# Altium project PCB_Project_Transmit_Stend_ver0.0.1.PrjPcb (part 2 of 2)
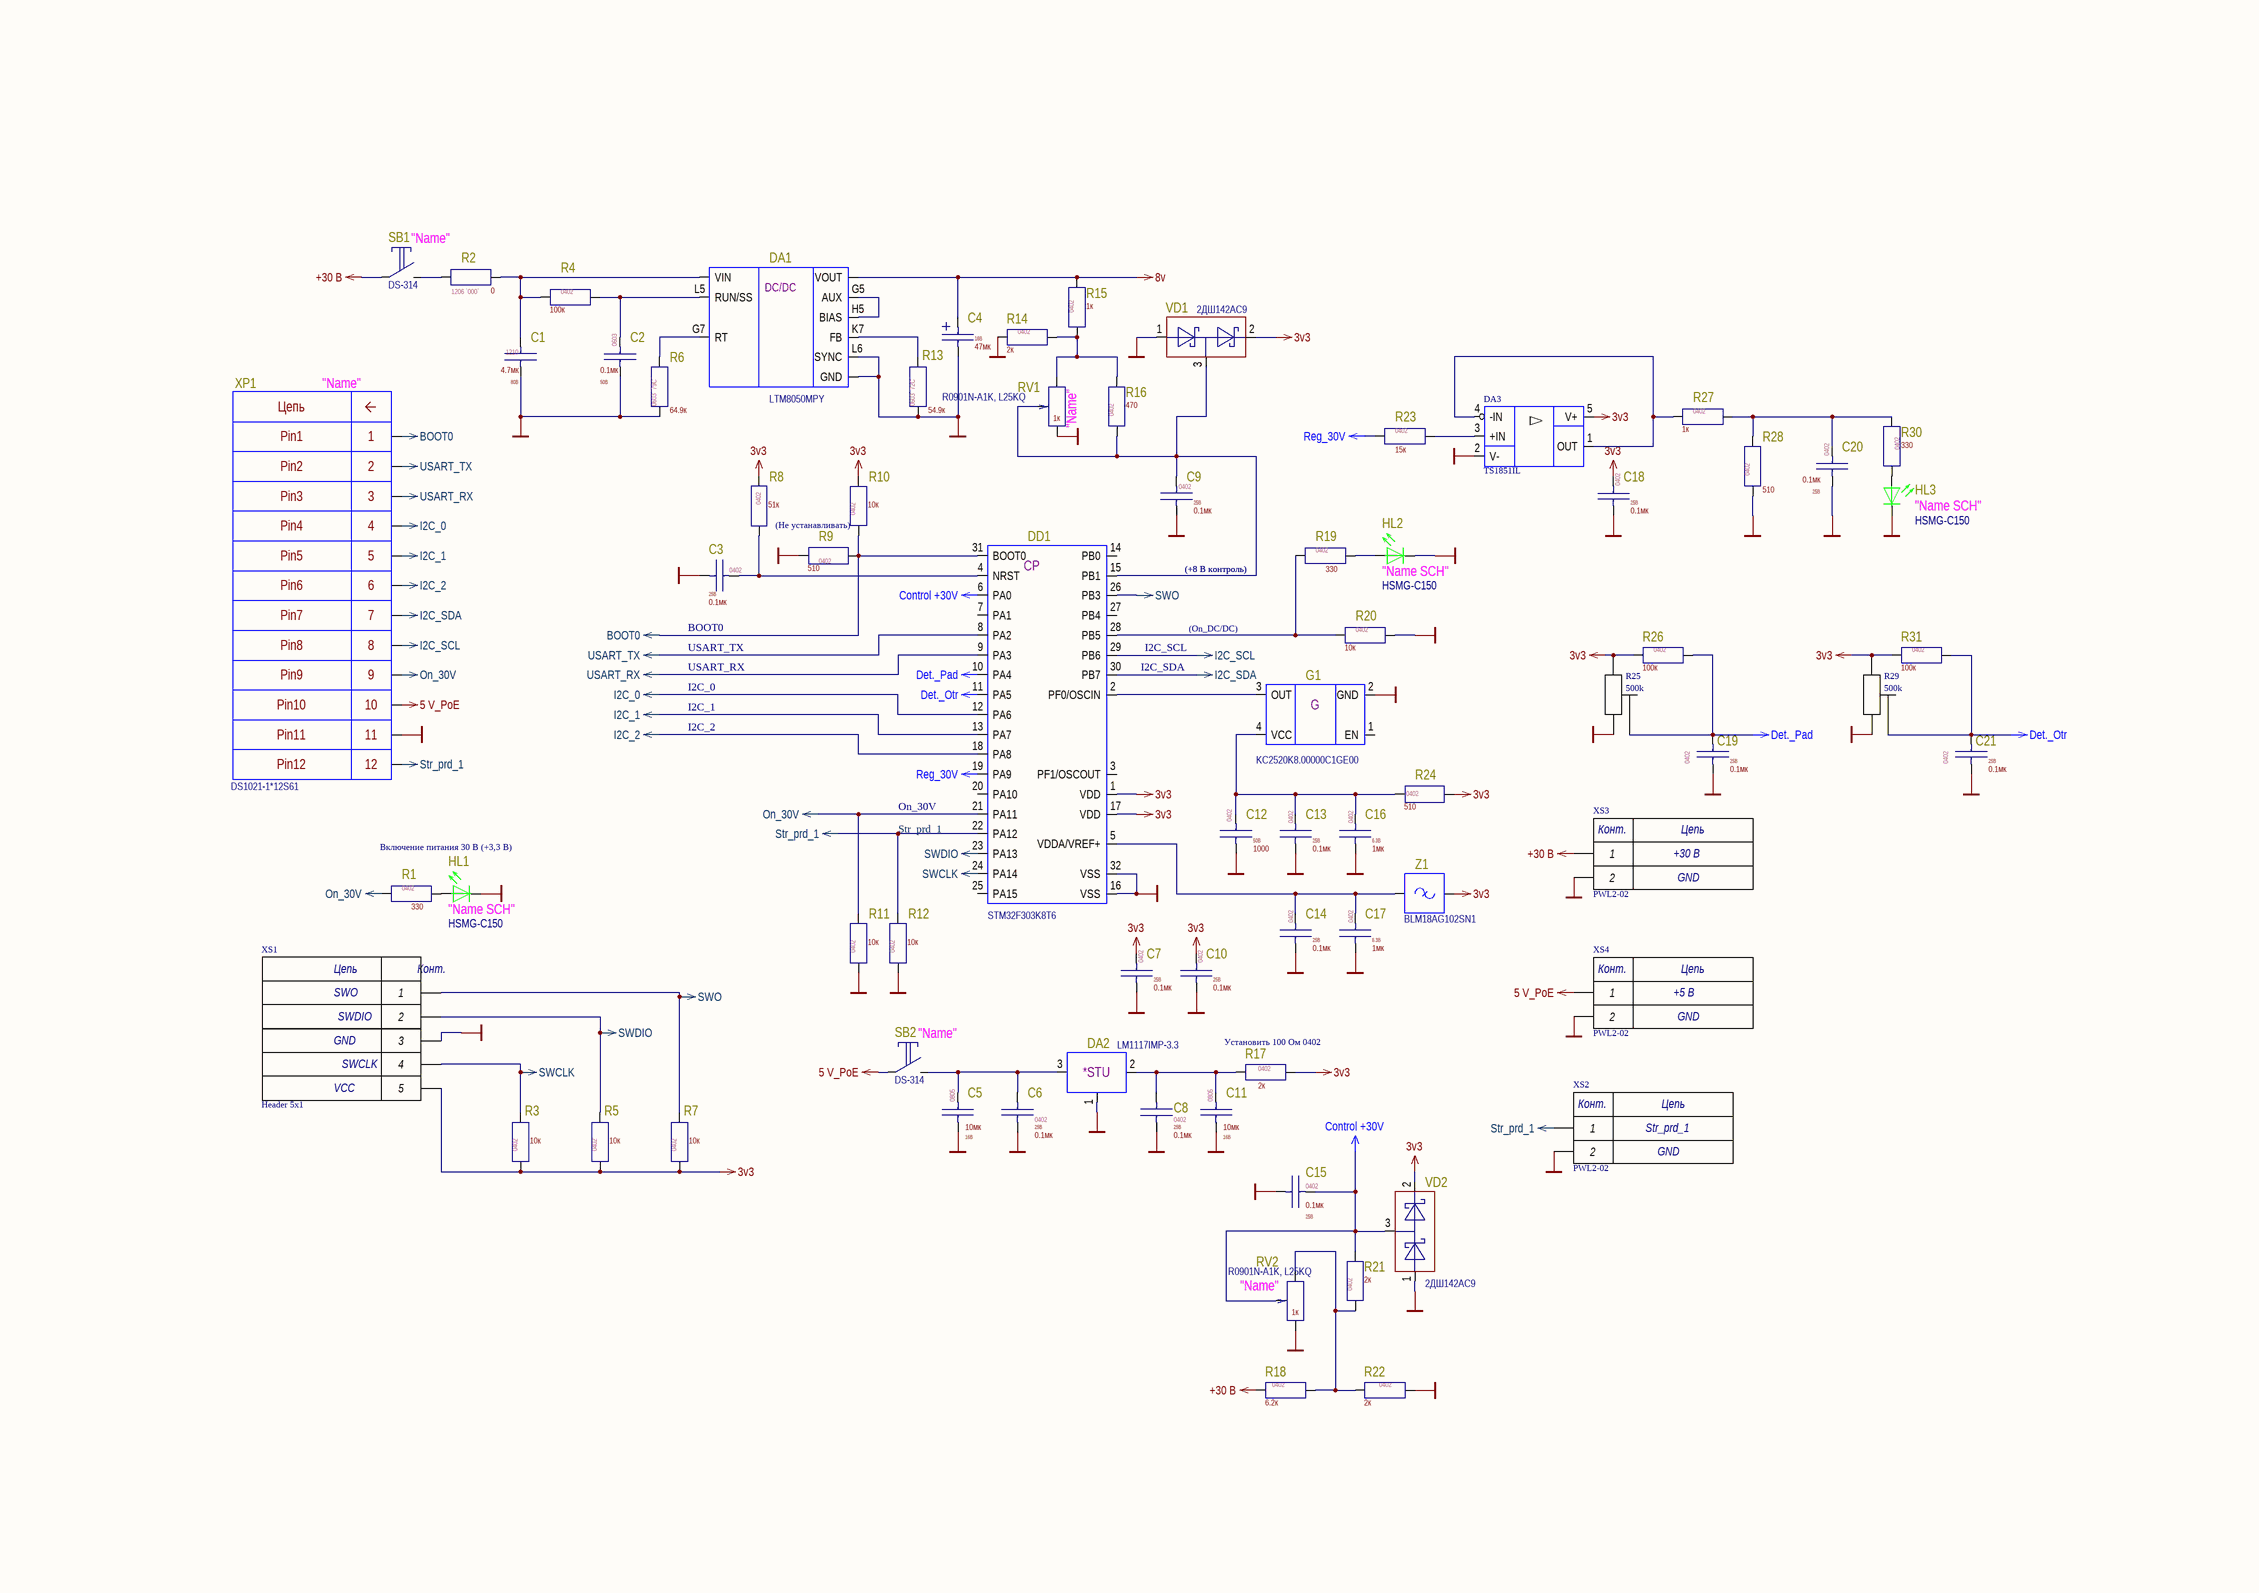
[diagram p1: Контроллер.SchDoc]

## Sheet Контроллер.SchDoc: =GlobalProjectName (continued)

### Library data of the parts
C1 = 9000000892309: 1210 Chip Monolithic Ceramic Capacitor GRM Series High Dielectric Constant Type; ManufacturerPartNumber: GRM32ER71K475M; Manufacturer: Murata; Manufacturer Today: Murata [mu]; Rem: Derating; КРР 14 по НД: 4$0,8; Автор: Стулов Н. Н.; Длина (L): 3.2мм; Ширина (W): 2.5мм; Tolerance: ±20%; Наименование BOM: Конденсатор 4.7мкФ ±20% 80В GRM32ER71K475M, Murata; Наименование КРР: Конденсатор GRM32ER71K475M; Наименование КРР ф4: Конденсатор GRM32ER7; КРР ф4_9: -55; КРР ф4_10: 125; КРР Форма: 67; КРР 1 по НД: 80; КРР 12 по НД: от -55 до 125; № п/п: 1160; Масса (m): 0.11г; Дескрипторы: 4,7 4,7м 4,7мк 4.7м 4.7мк 4,7v 4,7vr 4.7v 4.7vr; BCPId_old: Cmu06774; Наличие: 0|18|0; BCPId: 9000000892309; Аналоги: *; КРР 1 по схеме: *; КРР 2 по схеме: *; КРР 3 по схеме: *; КРР 12 по схеме: *; t: -55…+125°C; Дата создания: 04.10.2013; Высота (H): 2.5мм; TKE: X7R; КРР 2 по НД: 80; КРР 3 по НД: 80; КРР 4 по НД: 80; ComponentLink1Description: DataSheet; ComponentLink1URL: L:\Links\DataSheet\Murata\C02E Chip Monolithic Ceramic 2013-09-25.pdf; ComponentLink2Description: Виза; ComponentLink2URL: L:\Links\Виза\p\p1 `Приложение №2.pdf; Дата ревизии: 16.10.2023
C2 = 9000000481985: 0603 Chip Monolithic Ceramic Capacitor GRM Series High Dielectric Constant Type; ManufacturerPartNumber: GRM188R71H104K; Manufacturer: Murata; Manufacturer Today: Murata [mu]; КРР 14 по НД: 4$0,8; КРР 12 по схеме: от -50 до 70; Автор: Стулов Н. Н.; Длина (L): 1.6мм; Ширина (W): 0.8мм; Tolerance: ±10%; Наименование BOM: Конденсатор 0.1мкФ ±10% 50В GRM188R71H104K, Murata; Наименование КРР: Конденсатор GRM188R71H104K; Наименование КРР ф4: Конденсатор GRM188R7; КРР ф4_9: -55; КРР ф4_10: 125; КРР Форма: 67; КРР 1 по НД: 50; КРР 12 по НД: от -55 до 125; № п/п: 2434; Масса (m): 0.1г; Дескрипторы: 0,1 100н 100n 0,1м 0,1мк 0.1м 0.1мк 100y 100т 0,1v 0,1vr 0.1v 0.1vr; BCPId_old: Cmu06300; Наличие: 142; BCPId: 9000000481985; Rem: *; Аналоги: *; КРР 1 по схеме: *; КРР 2 по схеме: *; КРР 3 по схеме: *; t: -55…+125°C; Дата создания: 04.10.2013; Высота (H): 0.8мм; TKE: X7R; КРР 2 по НД: 50; КРР 3 по НД: 50; КРР 4 по НД: 50; ComponentLink1Description: DataSheet; ComponentLink1URL: L:\Links\DataSheet\Murata\C02E Chip Monolithic Ceramic 2013-09-25.pdf; ComponentLink2Description: Виза; ComponentLink2URL: L:\Links\Виза\p\p1 `Приложение №2.pdf; Дата ревизии: 16.10.2023
C3 C7 C9 C10 C13-C15 C18-C21 = 9000000420953: 0402 Chip Monolithic Ceramic Capacitor GRM Series High Dielectric Constant Type; ManufacturerPartNumber: GRM155R71E104M; Manufacturer: Murata; Manufacturer Today: Murata [mu]; КРР 14 по НД: 4$0,8; Автор: Стулов Н. Н.; Длина (L): 1мм; Ширина (W): 0.5мм; Tolerance: ±20%; Наименование BOM: Конденсатор 0.1мкФ ±20% 25В GRM155R71E104M, Murata; Наименование КРР: Конденсатор GRM155R71E104M; Наименование КРР ф4: Конденсатор GRM155R7; КРР ф4_9: -55; КРР ф4_10: 125; КРР Форма: 67; КРР 1 по НД: 25; КРР 12 по НД: от -55 до 125; № п/п: 2373; Масса (m): 0.1г; Дескрипторы: 0,1 100н 100n 0,1м 0,1мк 0.1м 0.1мк 100y 100т 0,1v 0,1vr 0.1v 0.1vr; BCPId_old: Cmu06129; Наличие: 0|307|0; BCPId: 9000000420953; Rem: *; Аналоги: *; КРР 1 по схеме: *; КРР 2 по схеме: *; КРР 3 по схеме: *; КРР 12 по схеме: *; t: -55…+125°C; Дата создания: 04.10.2013; Высота (H): 0.5мм; TKE: X7R; КРР 2 по НД: 25; КРР 3 по НД: 25; КРР 4 по НД: 25; ComponentLink1Description: DataSheet; ComponentLink1URL: L:\Links\DataSheet\Murata\C02E Chip Monolithic Ceramic 2013-09-25.pdf; ComponentLink2Description: Виза; ComponentLink2URL: L:\Links\Виза\p\p1 `Приложение №2.pdf; Дата ревизии: 10.10.2023
C4 = 9000001412643: 2412 Standard Tantalum Capacitor; ManufacturerPartNumber: TAJC476M016; Manufacturer: AVX; Manufacturer Today: AVX [av]; Корпус: 2412; КРР 14 по НД: 4$0,8; Автор: Стулов Н. Н.; Высота (H): 2.6мм; Tolerance: ±20%; Наименование BOM: Конденсатор 47мкФ 16В TAJC476M016, AVX; Наименование КРР: Конденсатор TAJC476M016; Наименование КРР ф4: Конденсатор TAJC; КРР ф4_9: -55; КРР ф4_10: 125; КРР Форма: 67; КРР 1 по НД: 16; КРР 12 по НД: от -55 до 125; Длина (L): 6мм; Ширина (W): 3.2мм; № п/п: 1189; Масса (m): 0.17г; Дескрипторы: 47 47м 47мк 47v 47vr; BCPId_old: Cav01189; Наличие: 0|18|0; BCPId: 9000001412643; Rem: *; Аналоги: *; КРР 1 по схеме: *; КРР 12 по схеме: *; t: -55…+125°C; Дата создания: 12.11.2012; Case: C; КРР 4 по НД: 16; ComponentLink1Description: DataSheet; ComponentLink1URL: L:\Links\DataSheet\AVX\Tantalum and Niobium Oxide Capacitors v13.9.pdf; ComponentLink2Description: DataSheet 2; ComponentLink2URL: L:\Links\DataSheet\AVX\AVX-ATC-PCN-102920.pdf; ComponentLink3Description: Виза; ComponentLink3URL: L:\Links\Виза\p\p1 `Приложение №2.pdf; Дата ревизии: 12.09.2022
C5 C11 = 9000000583030: 0805 Chip Monolithic Ceramic Capacitor GRM Series High Dielectric Constant Type; ManufacturerPartNumber: GRM219R61C106M; Manufacturer: Murata; Manufacturer Today: Murata [mu]; КРР 14 по НД: 4$0,8; № п/п: 1777; Автор: Стулов Н. Н.; Длина (L): 2мм; Ширина (W): 1.25мм; Высота (H): 0.85мм; Масса (m): 0.1г; Tolerance: ±20%; Наименование BOM: Конденсатор 10мкФ ±20% 16В GRM219R61C106M, Murata; Наименование КРР: Конденсатор GRM219R61C106M; Наименование КРР ф4: Конденсатор GRM219R6; КРР ф4_9: -55; КРР ф4_10: 85; КРР Форма: 67; КРР 1 по НД: 16; КРР 12 по НД: от -55 до 85; Дескрипторы: 10 10м 10мк 10v 10vr; BCPId_old: Cmu06519; Наличие: 0|0|416; BCPId: 9000000583030; Rem: *; Аналоги: *; КРР 1 по схеме: *; КРР 2 по схеме: *; КРР 3 по схеме: *; КРР 12 по схеме: *; ComponentLink1Description: DataSheet; ComponentLink1URL: L:\Links\DataSheet\Murata\C02E Chip Monolithic Ceramic 2013-09-25.pdf; ComponentLink2Description: Виза; ComponentLink2URL: L:\Links\Виза\p\p1 `Приложение №2.pdf; t: -55…+85°C; Дата создания: 04.10.2013; Дата ревизии: 16.10.2023; TKE: X5R; КРР 2 по НД: 16; КРР 3 по НД: 16; КРР 4 по НД: 16
C6 C8 = 9000000420953: 0402 Chip Monolithic Ceramic Capacitor GRM Series High Dielectric Constant Type; ManufacturerPartNumber: GRM155R71E104M; Manufacturer: Murata; Manufacturer Today: Murata [mu]; КРР 14 по НД: 4$0,8; № п/п: 2373; Автор: Стулов Н. Н.; Длина (L): 1мм; Ширина (W): 0.5мм; Масса (m): 0.1г; Tolerance: ±20%; Наименование BOM: Конденсатор 0.1мкФ ±20% 25В GRM155R71E104M, Murata; Наименование КРР: Конденсатор GRM155R71E104M; Наименование КРР ф4: Конденсатор GRM155R7; КРР ф4_9: -55; КРР ф4_10: 125; КРР Форма: 67; КРР 1 по НД: 25; КРР 12 по НД: от -55 до 125; Дескрипторы: 0,1 100н 100n 0,1м 0,1мк 0.1м 0.1мк 100y 100т 0,1v 0,1vr 0.1v 0.1vr; BCPId_old: Cmu06129; Наличие: 0|307|0; BCPId: 9000000420953; Rem: *; Аналоги: *; КРР 1 по схеме: *; КРР 2 по схеме: *; КРР 3 по схеме: *; КРР 12 по схеме: *; ComponentLink1Description: DataSheet; ComponentLink1URL: L:\Links\DataSheet\Murata\C02E Chip Monolithic Ceramic 2013-09-25.pdf; ComponentLink2Description: Виза; ComponentLink2URL: L:\Links\Виза\p\p1 `Приложение №2.pdf; t: -55…+125°C; Дата создания: 04.10.2013; Дата ревизии: 10.10.2023; Высота (H): 0.5мм; TKE: X7R; КРР 2 по НД: 25; КРР 3 по НД: 25; КРР 4 по НД: 25
C12 = 9000000415034: 0402 Chip Monolithic Ceramic Capacitor GRM Series Temperature Compensating Type; ManufacturerPartNumber: GRM1555C1H102J; Manufacturer: Murata; Manufacturer Today: Murata [mu]; КРР 14 по НД: 4$0,8; Автор: Стулов Н. Н.; Длина (L): 1мм; Ширина (W): 0.5мм; Tolerance: ±5%; Наименование BOM: Конденсатор 1000пФ ±5% 50В GRM1555C1H102J, Murata; Наименование КРР: Конденсатор GRM1555C1H102J; Наименование КРР ф4: Конденсатор GRM1555C; КРР ф4_9: -55; КРР ф4_10: 125; КРР Форма: 67; КРР 1 по НД: 50; КРР 12 по НД: от -55 до 125; № п/п: 1781; Масса (m): 0.1г; Дескрипторы: 1000 1000R 1000п 1000p 1н 1n 0,001м 0,001мк 1н 1n 0.001м 0.001мк 1000К 1000g 1000з 1y 1т 0,001v 0,001vr 1y 1т 0.001v 0.001vr; BCPId_old: Cmu03244; Наличие: 0|240|536; BCPId: 9000000415034; ComponentLink1Description: DataSheet; ComponentLink1URL: L:\Links\DataSheet\Murata\C02E Chip Monolithic Ceramic 2013-09-25.pdf; t: -55…+125°C; Дата создания: 04.10.2013; Высота (H): 0.5мм; TKE: C0G; КРР 2 по НД: 50; КРР 3 по НД: 50; КРР 4 по НД: 50; Rem: *; Аналоги: *; КРР 1 по схеме: *; КРР 2 по схеме: *; КРР 3 по схеме: *; КРР 12 по схеме: *; ComponentLink2Description: Виза; ComponentLink2URL: L:\Links\Виза\p\p1 `Приложение №2.pdf; Дата ревизии: 10.10.2023
C16 C17 = 9000000420076: 0402 Chip Monolithic Ceramic Capacitor GRM Series High Dielectric Constant Type; ManufacturerPartNumber: GRM153R60J105M; Manufacturer: Murata; Manufacturer Today: Murata [mu]; КРР 14 по НД: 4$0,8; Автор: Стулов Н. Н.; Длина (L): 1мм; Ширина (W): 0.5мм; Высота (H): 0.3мм; Tolerance: ±20%; Наименование BOM: Конденсатор 1мкФ ±20% 6.3В GRM153R60J105M, Murata; Наименование КРР: Конденсатор GRM153R60J105M; Наименование КРР ф4: Конденсатор GRM153R6; КРР ф4_9: -55; КРР ф4_10: 85; КРР Форма: 67; КРР 1 по НД: 6,3; КРР 12 по НД: от -55 до 85; № п/п: 2285; Масса (m): 0.1г; Дескрипторы: 1 1м 1мк 1v 1vr; BCPId_old: Cmu06041; Наличие: 0|0|138; BCPId: 9000000420076; ComponentLink1Description: DataSheet; ComponentLink1URL: L:\Links\DataSheet\Murata\C02E Chip Monolithic Ceramic 2013-09-25.pdf; t: -55…+85°C; Дата создания: 04.10.2013; TKE: X5R; КРР 2 по НД: 6,3; КРР 3 по НД: 6,3; КРР 4 по НД: 6,3; Rem: *; Аналоги: *; КРР 1 по схеме: *; КРР 2 по схеме: *; КРР 3 по схеме: *; КРР 12 по схеме: *; ComponentLink2Description: Виза; ComponentLink2URL: L:\Links\Виза\p\p1 `Приложение №2.pdf; Дата ревизии: 10.10.2023
DA1 = 9000001569781: 58V, 2A Step-Down µModule Regulator; Manufacturer: Linear Technology; Manufacturer Today: Analog Devices [ad]; t: -50…+125°C; Автор: Стулов Н. Н.; Длина (L): 15мм; Ширина (W): 9мм; Высота (H): 5мм; Шаг (F): 1.27мм; Power\Voltage: 0.8…24В, 2А; Наименование BOM: Микросхема LTM8050MPY, Linear Technology; Наименование КРР: Микросхема LTM8050MPY; Наименование КРР ф4: Микросхема  LTM8050; КРР ф4_9: -55; КРР ф4_10: 125; КРР Форма: 83; КРР 14 по НД: от -50 до 125; КРР 15 по НД: 245; № п/п: 320; Масса (m): 1.8г; КРР 7 по схеме: 0; BCPId_old: D00131; Наличие: 0|18|0; Корпус: DSBGA 15x9x5 70balls `LTM8050Y`; BCPId: 9000001569781; Rem: *; Аналоги: *; КРР 14 по схеме: *; КРР 15 по схеме: *; ComponentLink1Description: DataSheet; ComponentLink1URL: L:\Links\DataSheet\Analog Devices\LTM8050 `Linear.pdf; Дата создания: 04.07.2019; Дата ревизии: 04.07.2019; ComponentLink2Description: Case; ComponentLink2URL: L:\Links\Case\BGA70_1918.pdf
DA2 = 9000001556774: 3.3В, 0.8А. Positive voltage Regulator; Manufacturer: Texas Instruments; Manufacturer Today: Texas Instruments [tx]; Автор: Стулов Н. Н.; № п/п: 231; t: -40…+125°C; Длина (L): 6.5мм; Ширина (W): 3.5мм; Высота (H): 1.8мм; Шаг (F): 2.3мм; Масса (m): 0.112г; Tolerance: ±1%; Наименование BOM: Микросхема LM1117IMP-3.3, Texas Instruments; Наименование КРР: Микросхема LM1117IMP-3.3; Наименование КРР ф4: Микросхема  LM1117; КРР ф4_9: -65; КРР ф4_10: 150; КРР Форма: 64; КРР 4 по НД: 3#от 4,5 до 15; КРР 7 по НД: 2#800; КРР 8 по НД: от 1,2 до 11,7; КРР 12 по НД: от -40 до 125; BCPId_old: D00328; Наличие: 0|0|0; Rem: *; Корпус: SOT-223 `N05B`; BCPId: 9000001556774; Аналоги: *; КРР 4 по схеме: *; КРР 7 по схеме: *; КРР 8 по схеме: *; КРР 12 по схеме: *; ComponentLink1Description: DataSheet; ComponentLink1URL: L:\Links\DataSheet\Texas Instruments\LM1117.pdf; ComponentLink2Description: Case; ComponentLink2URL: L:\Links\Case\DCY (R-PDSO-G4) `TI.pdf; ComponentLink3Description: Case 2; ComponentLink3URL: L:\Links\Case\KC-3 `AD.pdf; ComponentLink4Description: Case 3; ComponentLink4URL: L:\Links\Case\SOT-223 (HIGH VOLTAGE) `Vishay.pdf; ComponentLink5Description: Case 4; ComponentLink5URL: L:\Links\Case\SOT223 `Diodes.pdf; ComponentLink6Description: Case 5; ComponentLink6URL: L:\Links\Case\SOT223 `NXP.pdf; Дата создания: 28.08.2018; Дата ревизии: 28.08.2018; Power\Voltage: 3.3В, 0.8А
DA3 = OPER_USIL
DD1 = 9000001585200: ArmCortex-M4 32b MCU+FPU, up to 64KB Flash, 16KB SRAM ,  2 ADCs, 3 DACs, 3 comp., op-amp 2.0 - 3.6 V; Manufacturer: STMicroelectronics; Manufacturer Today: STMicroelectronics [st]; № п/п: 337; t: -40…+85°C; Автор: Стулов Н. Н.; Длина (L): 7мм; Высота (H): 1.6мм; Шаг (F): 0.8мм; Масса (m): 0.1г; Наименование BOM: Микросхема STM32F303K8T6, STMicroelectronics; Наименование КРР: Микросхема STM32F303K8T6; Наименование КРР ф4: Микросхема  STM32F303; КРР ф4_9: -65; КРР ф4_10: 150; КРР Форма: 65; КРР 15 по НД: от -40 до 85; BCPId_old: D00506; Наличие: 0|36|0; Корпус: LQFP-32; BCPId: 9000001585200; Rem: *; Аналоги: *; КРР 15 по схеме: *; ComponentLink1Description: DataSheet; ComponentLink1URL: L:\Links\DataSheet\STMicroelectronics\STM32F303.pdf; ComponentLink2Description: Case; ComponentLink2URL: L:\Links\Case\LQFP32 `ST.pdf; ComponentLink3Description: Case 2; ComponentLink3URL: L:\Links\Case\ST-32-2 `AD.pdf; ComponentLink4Description: Case 3; ComponentLink4URL: L:\Links\Case\SU-32-2 `AD.pdf; Дата создания: 05.10.2022; Дата ревизии: 05.10.2022; Ширина (W): 7мм
G1 = 9000003923703: CMOS Clock Oscillators SMT, 8МГц, от 1.6 до 3.63V, 2.5x2mm; Manufacturer: Kyocera; Manufacturer Today: Kyocera [ky]; Корпус: OSC 2.5x2x0.8 4pin; t: -40…+85°C; Автор: Стулов Н. Н.; Длина (L): 2.5мм; Ширина (W): 2мм; Высота (H): 0.8мм; Наименование BOM: Микросхема KC2520B8.00000C1GE00, Kyocera; Наименование КРР: Микросхема KC2520B8.00000C1GE00; Наименование КРР ф4: Микросхема  KC2520B; КРР ф4_9: -55; КРР ф4_10: 125; КРР Форма: 69; КРР 2 по НД: 15; КРР 5 по НД: от 1.6 до 3,63; КРР 11 по НД: от -40 до 85; № п/п: 207; Масса (m): 0.1г; Наличие: 0|18|0; BCPId: 9000003923703; ComponentLink1Description: DataSheet; ComponentLink1URL: L:\Links\DataSheet\Kyocera\KC2520K.pdf; Дата создания: 28.09.2023; Value: 8МГц; Rem: *; Аналоги: *; КРР 2 по схеме: *; КРР 5 по схеме: *; КРР 6 по схеме: *; КРР 11 по схеме: *; Дата ревизии: 28.09.2023; КРР 6 по НД: от 1.6 до 3,63
HL1-HL3 = 9000001621601: 1206 LED (Green, Untinted, Diffused); Manufacturer: Agilent Technologies; Manufacturer Today: Broadcom [bc]; Корпус: 1206; КРР 9 по схеме: от -50 до 70; _NamePCB: {Name_PCB}; № п/п: 3; t: -30…+85°C; Автор: Стулов Н. Н.; Длина (L): 3.2мм; Ширина (W): 1.6мм; Высота (H): 1.1мм; Масса (m): 0.1г; Intensity: 15мкд; Wavelength: 572нм; Viewing Angle: 155°; Наименование BOM: Светодиод HSMG-C150, Agilent Technologies; Наименование КРР: Светодиод HSMG-C150; КРР ф4_9: -40; КРР ф4_10: 85; КРР Форма: 35; КРР 9 по НД: от -30 до 85; КРР 10 по НД: 6$0,7; BCPId_old: Hbc00003; Наличие: 0; ManufacturerPartNumber: HSMG-C150; BCPId: 9000001621601; Rem: *; Аналоги: *; ComponentLink1Description: DataSheet; ComponentLink1URL: L:\Links\DataSheet\Broadcom\HSMx-C `Agilent.pdf; ComponentLink2Description: DataSheet 2; ComponentLink2URL: L:\Links\DataSheet\Broadcom\HSMx-C `Avago.pdf; Дата создания: 19.02.2014; Дата ревизии: 19.02.2014; Color: Green; Наименование КРР ф4: Светодиод HSMG-C150
R1 R19 R30 = 9000002352979: Chip resistor; ManufacturerPartNumber: CR0402-JW-331; Manufacturer: Bourns; Manufacturer Today: Bourns [br]; Tolerance: ±5%; КРР 15 по НД: 13$0,5; № п/п: 55; t: -55…+125°C; Автор: Стулов Н. Н.; Длина (L): 1мм; Ширина (W): 0.5мм; Высота (H): 0.35мм; Масса (m): 0.1г; TKC: ±200ppm/°C; Наименование BOM: Резистор 330Ом ±5% CR0402-JW-331, Bourns; Наименование КРР: Резистор CR0402-JW-331; Наименование КРР ф4: Резистор CR0402; КРР ф4_9: -55; КРР ф4_10: 125; КРР Форма: 68; КРР 1 по НД: 25; КРР 13 по НД: 0,0625; КРР 14 по НД: от -55 до 125; Дескрипторы: 330 330R; BCPId_old: Rbr00610; Наличие: 0|0|26; BCPId: 9000002352979; Rem: *; Аналоги: *; КРР 1 по схеме: *; КРР 2 по схеме: *; КРР 3 по схеме: *; КРР 13 по схеме: *; КРР 14 по схеме: *; ComponentLink1Description: DataSheet; ComponentLink1URL: L:\Links\DataSheet\Bourns\CR0402.pdf; Дата создания: 12.11.2012; Дата ревизии: 19.09.2022; Power\Voltage: 0.0625Вт; КРР 2 по НД: 25; КРР 3 по НД: 25; КРР 4 по НД: 25
R2 = 9000002775211: Chip resistor; ManufacturerPartNumber: RK73Z2BT; Manufacturer: KOA Speer; Manufacturer Today: KOA Speer [ko]; КРР 15 по НД: 13$0,5; КРР 13 по схеме: #VALUE!; t: -55…+155°C; Автор: Стулов Н. Н.; Длина (L): 3.2мм; Ширина (W): 1.6мм; Высота (H): 0.6мм; Наименование BOM: Резистор 0Ом  RK73Z2BT, KOA Speer; Наименование КРР: Резистор RK73Z2BT; Наименование КРР ф4: Резистор RK73Z; КРР ф4_9: -55; КРР ф4_10: 155; КРР Форма: 68; КРР 1 по НД: 200; КРР 14 по НД: от -55 до 155; № п/п: 874; Масса (m): 0.1г; BCPId_old: Rko00000; Наличие: 0|18|0; BCPId: 9000002775211; Rem: *; Аналоги: *; КРР 1 по схеме: *; КРР 2 по схеме: *; КРР 3 по схеме: *; КРР 14 по схеме: *; Дата создания: 31.05.2019; Power\Voltage: 0; КРР 2 по НД: 200; КРР 3 по НД: 200; КРР 4 по НД: 200; КРР 13 по НД: #VALUE!; Tolerance: *; ComponentLink1Description: DataSheet; ComponentLink1URL: L:\Links\DataSheet\KOA Speer\RK73Z.pdf; Дата ревизии: 31.05.2019
R3 R5 R7 R10-R12 R20 = 9000002353334: Chip resistor; ManufacturerPartNumber: CR0402-JW-103; Manufacturer: Bourns; Manufacturer Today: Bourns [br]; Tolerance: ±5%; КРР 15 по НД: 13$0,5; № п/п: 91; t: -55…+125°C; Автор: Стулов Н. Н.; Длина (L): 1мм; Ширина (W): 0.5мм; Высота (H): 0.35мм; Масса (m): 0.1г; TKC: ±200ppm/°C; Наименование BOM: Резистор 10кОм ±5% CR0402-JW-103, Bourns; Наименование КРР: Резистор CR0402-JW-103; Наименование КРР ф4: Резистор CR0402; КРР ф4_9: -55; КРР ф4_10: 125; КРР Форма: 68; КРР 1 по НД: 25; КРР 13 по НД: 0,0625; КРР 14 по НД: от -55 до 125; BCPId_old: Rbr00970; Наличие: 0|174|0; BCPId: 9000002353334; Rem: *; Аналоги: *; КРР 1 по схеме: *; КРР 2 по схеме: *; КРР 3 по схеме: *; КРР 13 по схеме: *; КРР 14 по схеме: *; ComponentLink1Description: DataSheet; ComponentLink1URL: L:\Links\DataSheet\Bourns\CR0402.pdf; Дата создания: 12.11.2012; Дата ревизии: 19.09.2022; Power\Voltage: 0.0625Вт; КРР 2 по НД: 25; КРР 3 по НД: 25; КРР 4 по НД: 25; Дескрипторы: 10к
R4 = 9000002353570: Chip resistor; ManufacturerPartNumber: CR0402-JW-104; Manufacturer: Bourns; Manufacturer Today: Bourns [br]; КРР 15 по НД: 13$0,5; t: -55…+125°C; Автор: Стулов Н. Н.; Длина (L): 1мм; Ширина (W): 0.5мм; Высота (H): 0.35мм; Tolerance: ±5%; TKC: ±200ppm/°C; Наименование BOM: Резистор 100кОм ±5% CR0402-JW-104, Bourns; Наименование КРР: Резистор CR0402-JW-104; Наименование КРР ф4: Резистор CR0402; КРР ф4_9: -55; КРР ф4_10: 125; КРР Форма: 68; КРР 1 по НД: 25; КРР 13 по НД: 0,0625; КРР 14 по НД: от -55 до 125; № п/п: 115; Масса (m): 0.1г; BCPId_old: Rbr01210; Наличие: 0|60|60; BCPId: 9000002353570; ComponentLink1Description: DataSheet; ComponentLink1URL: L:\Links\DataSheet\Bourns\CR0402.pdf; Дата создания: 12.11.2012; Power\Voltage: 0.0625Вт; КРР 2 по НД: 25; КРР 3 по НД: 25; КРР 4 по НД: 25; Rem: *; Аналоги: *; КРР 1 по схеме: *; КРР 2 по схеме: *; КРР 3 по схеме: *; КРР 13 по схеме: *; КРР 14 по схеме: *; Дата ревизии: 19.09.2022; Дескрипторы: 100к
R6 = 9000002486971: Chip resistor; ManufacturerPartNumber: CR0603-FX-6492; Manufacturer: Bourns; Manufacturer Today: Bourns [br]; КРР 15 по НД: 13$0,5; t: -55…+155°C; Автор: Стулов Н. Н.; Длина (L): 1.6мм; Ширина (W): 0.8мм; Высота (H): 0.45мм; Tolerance: ±1%; TKC: ±100ppm/°C; Наименование BOM: Резистор 64.9кОм ±1% CR0603-FX-6492, Bourns; Наименование КРР: Резистор CR0603-FX-6492; Наименование КРР ф4: Резистор CR; КРР ф4_9: -55; КРР ф4_10: 155; КРР Форма: 68; КРР 1 по НД: 50; КРР 13 по НД: 0,1; КРР 14 по НД: от -55 до 155; № п/п: 538; Масса (m): 0.1г; Дескрипторы: 64,9к 64.9к 64к9; BCPId_old: Rbr00484; Наличие: 0|18|0; BCPId: 9000002486971; Rem: *; Аналоги: *; КРР 1 по схеме: *; КРР 2 по схеме: *; КРР 3 по схеме: *; КРР 13 по схеме: *; КРР 14 по схеме: *; Дата создания: 08.11.2017; Power\Voltage: 0.1Вт; КРР 2 по НД: 50; КРР 3 по НД: 50; КРР 4 по НД: 50; ComponentLink1Description: DataSheet; ComponentLink1URL: L:\Links\DataSheet\Bourns\CR0603(0805)(1206).pdf; Дата ревизии: 08.11.2017
R8 = 9000002353501: Chip resistor; ManufacturerPartNumber: CR0402-JW-513; Manufacturer: Bourns; Manufacturer Today: Bourns [br]; Tolerance: ±5%; КРР 15 по НД: 13$0,5; № п/п: 108; t: -55…+125°C; Автор: Стулов Н. Н.; Длина (L): 1мм; Ширина (W): 0.5мм; Высота (H): 0.35мм; Масса (m): 0.1г; TKC: ±200ppm/°C; Наименование BOM: Резистор 51кОм ±5% CR0402-JW-513, Bourns; Наименование КРР: Резистор CR0402-JW-513; Наименование КРР ф4: Резистор CR0402; КРР ф4_9: -55; КРР ф4_10: 125; КРР Форма: 68; КРР 1 по НД: 25; КРР 13 по НД: 0,0625; КРР 14 по НД: от -55 до 125; BCPId_old: Rbr01140; Наличие: 0|18|0; BCPId: 9000002353501; Rem: *; Аналоги: *; КРР 1 по схеме: *; КРР 2 по схеме: *; КРР 3 по схеме: *; КРР 13 по схеме: *; КРР 14 по схеме: *; ComponentLink1Description: DataSheet; ComponentLink1URL: L:\Links\DataSheet\Bourns\CR0402.pdf; Дата создания: 12.11.2012; Дата ревизии: 19.09.2022; Power\Voltage: 0.0625Вт; КРР 2 по НД: 25; КРР 3 по НД: 25; КРР 4 по НД: 25; Дескрипторы: 51к
R9 = 9000002353020: Chip resistor; ManufacturerPartNumber: CR0402-JW-511; Manufacturer: Bourns; Manufacturer Today: Bourns [br]; Tolerance: ±5%; КРР 15 по НД: 13$0,5; t: -55…+125°C; Автор: Стулов Н. Н.; Длина (L): 1мм; Ширина (W): 0.5мм; Высота (H): 0.35мм; TKC: ±200ppm/°C; Наименование BOM: Резистор 510Ом ±5% CR0402-JW-511, Bourns; Наименование КРР: Резистор CR0402-JW-511; Наименование КРР ф4: Резистор CR0402; КРР ф4_9: -55; КРР ф4_10: 125; КРР Форма: 68; КРР 1 по НД: 25; КРР 13 по НД: 0,0625; КРР 14 по НД: от -55 до 125; Rem: не устанавливать; № п/п: 60; Масса (m): 0.1г; Дескрипторы: 510 510R; BCPId_old: Rbr00660; Наличие: 0|53|0; BCPId: 9000002353020; ComponentLink1Description: DataSheet; ComponentLink1URL: L:\Links\DataSheet\Bourns\CR0402.pdf; Дата создания: 12.11.2012; Power\Voltage: 0.0625Вт; КРР 2 по НД: 25; КРР 3 по НД: 25; КРР 4 по НД: 25; Аналоги: *; КРР 1 по схеме: *; КРР 2 по схеме: *; КРР 3 по схеме: *; КРР 13 по схеме: *; КРР 14 по схеме: *; Дата ревизии: 19.09.2022
R13 = 9000002486902: Chip resistor; ManufacturerPartNumber: CR0603-FX-5492; Manufacturer: Bourns; Manufacturer Today: Bourns [br]; КРР 15 по НД: 13$0,5; t: -55…+155°C; Автор: Стулов Н. Н.; Длина (L): 1.6мм; Ширина (W): 0.8мм; Высота (H): 0.45мм; Tolerance: ±1%; TKC: ±100ppm/°C; Наименование BOM: Резистор 54.9кОм ±1% CR0603-FX-5492, Bourns; Наименование КРР: Резистор CR0603-FX-5492; Наименование КРР ф4: Резистор CR; КРР ф4_9: -55; КРР ф4_10: 155; КРР Форма: 68; КРР 1 по НД: 50; КРР 13 по НД: 0,1; КРР 14 по НД: от -55 до 155; № п/п: 531; Масса (m): 0.1г; Дескрипторы: 54,9к 54.9к 54к9; BCPId_old: Rbr00474; Наличие: 0|18|0; BCPId: 9000002486902; Rem: *; Аналоги: *; КРР 1 по схеме: *; КРР 2 по схеме: *; КРР 3 по схеме: *; КРР 13 по схеме: *; КРР 14 по схеме: *; Дата создания: 08.11.2017; Power\Voltage: 0.1Вт; КРР 2 по НД: 50; КРР 3 по НД: 50; КРР 4 по НД: 50; ComponentLink1Description: DataSheet; ComponentLink1URL: L:\Links\DataSheet\Bourns\CR0603(0805)(1206).pdf; Дата ревизии: 08.11.2017
R14 R17 R21 R22 = 9000002353167: Chip resistor; ManufacturerPartNumber: CR0402-JW-202; Manufacturer: Bourns; Manufacturer Today: Bourns [br]; Tolerance: ±5%; КРР 15 по НД: 13$0,5; КРР 14 по схеме: от -50 до 70; № п/п: 74; t: -55…+125°C; Автор: Стулов Н. Н.; Длина (L): 1мм; Ширина (W): 0.5мм; Высота (H): 0.35мм; Масса (m): 0.1г; TKC: ±200ppm/°C; Наименование BOM: Резистор 2кОм ±5% CR0402-JW-202, Bourns; Наименование КРР: Резистор CR0402-JW-202; Наименование КРР ф4: Резистор CR0402; КРР ф4_9: -55; КРР ф4_10: 125; КРР Форма: 68; КРР 1 по НД: 25; КРР 13 по НД: 0,0625; КРР 14 по НД: от -55 до 125; Дескрипторы: 2к 2k; BCPId_old: Rbr00800; Наличие: 0; BCPId: 9000002353167; Rem: *; Аналоги: *; КРР 1 по схеме: *; КРР 2 по схеме: *; КРР 3 по схеме: *; КРР 13 по схеме: *; ComponentLink1Description: DataSheet; ComponentLink1URL: L:\Links\DataSheet\Bourns\CR0402.pdf; ComponentLink2Description: Виза; ComponentLink2URL: L:\Links\Виза\p\p3 `Приложение 2.pdf; Дата создания: 12.11.2012; Дата ревизии: 19.09.2022; Power\Voltage: 0.0625Вт; КРР 2 по НД: 25; КРР 3 по НД: 25; КРР 4 по НД: 25
R15 = 9000002353099: Chip resistor; ManufacturerPartNumber: CR0402-JW-102; Manufacturer: Bourns; Manufacturer Today: Bourns [br]; Tolerance: ±5%; КРР 15 по НД: 13$0,5; КРР 14 по схеме: от -50 до 70; № п/п: 67; t: -55…+125°C; Автор: Стулов Н. Н.; Длина (L): 1мм; Ширина (W): 0.5мм; Высота (H): 0.35мм; Масса (m): 0.1г; TKC: ±200ppm/°C; Наименование BOM: Резистор 1кОм ±5% CR0402-JW-102, Bourns; Наименование КРР: Резистор CR0402-JW-102; Наименование КРР ф4: Резистор CR0402; КРР ф4_9: -55; КРР ф4_10: 125; КРР Форма: 68; КРР 1 по НД: 25; КРР 13 по НД: 0,0625; КРР 14 по НД: от -55 до 125; Дескрипторы: 1к 1k; BCPId_old: Rbr00730; Наличие: 0; BCPId: 9000002353099; Rem: *; Аналоги: *; КРР 1 по схеме: *; КРР 2 по схеме: *; КРР 3 по схеме: *; КРР 13 по схеме: *; ComponentLink1Description: DataSheet; ComponentLink1URL: L:\Links\DataSheet\Bourns\CR0402.pdf; ComponentLink2Description: Виза; ComponentLink2URL: L:\Links\Виза\p\p3 `Приложение 2.pdf; Дата создания: 12.11.2012; Дата ревизии: 19.09.2022; Power\Voltage: 0.0625Вт; КРР 2 по НД: 25; КРР 3 по НД: 25; КРР 4 по НД: 25
R16 = 9000002353013: Chip resistor; ManufacturerPartNumber: CR0402-JW-471; Manufacturer: Bourns; Manufacturer Today: Bourns [br]; Tolerance: ±5%; КРР 15 по НД: 13$0,5; КРР 14 по схеме: от -50 до 70; № п/п: 59; t: -55…+125°C; Автор: Стулов Н. Н.; Длина (L): 1мм; Ширина (W): 0.5мм; Высота (H): 0.35мм; Масса (m): 0.1г; TKC: ±200ppm/°C; Наименование BOM: Резистор 470Ом ±5% CR0402-JW-471, Bourns; Наименование КРР: Резистор CR0402-JW-471; Наименование КРР ф4: Резистор CR0402; КРР ф4_9: -55; КРР ф4_10: 125; КРР Форма: 68; КРР 1 по НД: 25; КРР 13 по НД: 0,0625; КРР 14 по НД: от -55 до 125; Дескрипторы: 470 470R; BCPId_old: Rbr00650; Наличие: 0; BCPId: 9000002353013; Rem: *; Аналоги: *; КРР 1 по схеме: *; КРР 2 по схеме: *; КРР 3 по схеме: *; КРР 13 по схеме: *; ComponentLink1Description: DataSheet; ComponentLink1URL: L:\Links\DataSheet\Bourns\CR0402.pdf; ComponentLink2Description: Виза; ComponentLink2URL: L:\Links\Виза\p\p3 `Приложение 2.pdf; Дата создания: 12.11.2012; Дата ревизии: 19.09.2022; Power\Voltage: 0.0625Вт; КРР 2 по НД: 25; КРР 3 по НД: 25; КРР 4 по НД: 25
R18 = 9000002353280: Chip resistor; ManufacturerPartNumber: CR0402-JW-622; Manufacturer: Bourns; Manufacturer Today: Bourns [br]; Tolerance: ±5%; КРР 15 по НД: 13$0,5; КРР 14 по схеме: от -50 до 70; № п/п: 86; t: -55…+125°C; Автор: Стулов Н. Н.; Длина (L): 1мм; Ширина (W): 0.5мм; Высота (H): 0.35мм; Масса (m): 0.1г; TKC: ±200ppm/°C; Наименование BOM: Резистор 6.2кОм ±5% CR0402-JW-622, Bourns; Наименование КРР: Резистор CR0402-JW-622; Наименование КРР ф4: Резистор CR0402; КРР ф4_9: -55; КРР ф4_10: 125; КРР Форма: 68; КРР 1 по НД: 25; КРР 13 по НД: 0,0625; КРР 14 по НД: от -55 до 125; Дескрипторы: 6,2к 6.2к 6к2 6,2k 6.2k 6k2; BCPId_old: Rbr00920; Наличие: 0; BCPId: 9000002353280; Rem: *; Аналоги: *; КРР 1 по схеме: *; КРР 2 по схеме: *; КРР 3 по схеме: *; КРР 13 по схеме: *; ComponentLink1Description: DataSheet; ComponentLink1URL: L:\Links\DataSheet\Bourns\CR0402.pdf; ComponentLink2Description: Виза; ComponentLink2URL: L:\Links\Виза\p\p3 `Приложение 2.pdf; Дата создания: 12.11.2012; Дата ревизии: 19.09.2022; Power\Voltage: 0.0625Вт; КРР 2 по НД: 25; КРР 3 по НД: 25; КРР 4 по НД: 25
R23 = 9000002353372: Chip resistor; ManufacturerPartNumber: CR0402-JW-153; Manufacturer: Bourns; Manufacturer Today: Bourns [br]; Tolerance: ±5%; КРР 15 по НД: 13$0,5; t: -55…+125°C; Автор: Стулов Н. Н.; Длина (L): 1мм; Ширина (W): 0.5мм; Высота (H): 0.35мм; TKC: ±200ppm/°C; Наименование BOM: Резистор 15кОм ±5% CR0402-JW-153, Bourns; Наименование КРР: Резистор CR0402-JW-153; Наименование КРР ф4: Резистор CR0402; КРР ф4_9: -55; КРР ф4_10: 125; КРР Форма: 68; КРР 1 по НД: 25; КРР 13 по НД: 0,0625; КРР 14 по НД: от -55 до 125; № п/п: 95; Масса (m): 0.1г; BCPId_old: Rbr01010; Наличие: 0|18|0; BCPId: 9000002353372; ComponentLink1Description: DataSheet; ComponentLink1URL: L:\Links\DataSheet\Bourns\CR0402.pdf; Дата создания: 12.11.2012; Power\Voltage: 0.0625Вт; КРР 2 по НД: 25; КРР 3 по НД: 25; КРР 4 по НД: 25; Rem: *; Аналоги: *; КРР 1 по схеме: *; КРР 2 по схеме: *; КРР 3 по схеме: *; КРР 13 по схеме: *; КРР 14 по схеме: *; Дата ревизии: 19.09.2022; Дескрипторы: 15к
R24 = 9000002353020: Chip resistor; ManufacturerPartNumber: CR0402-JW-511; Manufacturer: Bourns; Manufacturer Today: Bourns [br]; Tolerance: ±5%; КРР 15 по НД: 13$0,5; № п/п: 60; t: -55…+125°C; Автор: Стулов Н. Н.; Длина (L): 1мм; Ширина (W): 0.5мм; Высота (H): 0.35мм; Масса (m): 0.1г; TKC: ±200ppm/°C; Наименование BOM: Резистор 510Ом ±5% CR0402-JW-511, Bourns; Наименование КРР: Резистор CR0402-JW-511; Наименование КРР ф4: Резистор CR0402; КРР ф4_9: -55; КРР ф4_10: 125; КРР Форма: 68; КРР 1 по НД: 25; КРР 13 по НД: 0,0625; КРР 14 по НД: от -55 до 125; Дескрипторы: 510 510R; BCPId_old: Rbr00660; Наличие: 0|53|0; BCPId: 9000002353020; Rem: *; Аналоги: *; КРР 1 по схеме: *; КРР 2 по схеме: *; КРР 3 по схеме: *; КРР 13 по схеме: *; КРР 14 по схеме: *; ComponentLink1Description: DataSheet; ComponentLink1URL: L:\Links\DataSheet\Bourns\CR0402.pdf; Дата создания: 12.11.2012; Дата ревизии: 19.09.2022; Power\Voltage: 0.0625Вт; КРР 2 по НД: 25; КРР 3 по НД: 25; КРР 4 по НД: 25
R25 R29 = Res_podstr
R26 R31 = 9000002353570: Chip resistor; ManufacturerPartNumber: CR0402-JW-104; Manufacturer: Bourns; Manufacturer Today: Bourns [br]; Tolerance: ±5%; КРР 15 по НД: 13$0,5; КРР 14 по схеме: от -50 до 70; № п/п: 115; t: -55…+125°C; Автор: Стулов Н. Н.; Длина (L): 1мм; Ширина (W): 0.5мм; Высота (H): 0.35мм; Масса (m): 0.1г; TKC: ±200ppm/°C; Наименование BOM: Резистор 100кОм ±5% CR0402-JW-104, Bourns; Наименование КРР: Резистор CR0402-JW-104; Наименование КРР ф4: Резистор CR0402; КРР ф4_9: -55; КРР ф4_10: 125; КРР Форма: 68; КРР 1 по НД: 25; КРР 13 по НД: 0,0625; КРР 14 по НД: от -55 до 125; Дескрипторы: 100к 100k; BCPId_old: Rbr01210; Наличие: 0; BCPId: 9000002353570; Rem: *; Аналоги: *; КРР 1 по схеме: *; КРР 2 по схеме: *; КРР 3 по схеме: *; КРР 13 по схеме: *; ComponentLink1Description: DataSheet; ComponentLink1URL: L:\Links\DataSheet\Bourns\CR0402.pdf; ComponentLink2Description: Виза; ComponentLink2URL: L:\Links\Виза\p\p3 `Приложение 2.pdf; Дата создания: 12.11.2012; Дата ревизии: 19.09.2022; Power\Voltage: 0.0625Вт; КРР 2 по НД: 25; КРР 3 по НД: 25; КРР 4 по НД: 25
R27 = 9000002353099: Chip resistor; ManufacturerPartNumber: CR0402-JW-102; Manufacturer: Bourns; Manufacturer Today: Bourns [br]; Tolerance: ±5%; КРР 15 по НД: 13$0,5; t: -55…+125°C; Автор: Стулов Н. Н.; Длина (L): 1мм; Ширина (W): 0.5мм; Высота (H): 0.35мм; TKC: ±200ppm/°C; Наименование BOM: Резистор 1кОм ±5% CR0402-JW-102, Bourns; Наименование КРР: Резистор CR0402-JW-102; Наименование КРР ф4: Резистор CR0402; КРР ф4_9: -55; КРР ф4_10: 125; КРР Форма: 68; КРР 1 по НД: 25; КРР 13 по НД: 0,0625; КРР 14 по НД: от -55 до 125; № п/п: 67; Масса (m): 0.1г; BCPId_old: Rbr00730; Наличие: 0|291|0; BCPId: 9000002353099; ComponentLink1Description: DataSheet; ComponentLink1URL: L:\Links\DataSheet\Bourns\CR0402.pdf; Дата создания: 12.11.2012; Power\Voltage: 0.0625Вт; КРР 2 по НД: 25; КРР 3 по НД: 25; КРР 4 по НД: 25; Rem: *; Аналоги: *; КРР 1 по схеме: *; КРР 2 по схеме: *; КРР 3 по схеме: *; КРР 13 по схеме: *; КРР 14 по схеме: *; Дата ревизии: 19.09.2022; Дескрипторы: 1к
R28 = 9000002353020: Chip resistor; ManufacturerPartNumber: CR0402-JW-511; Manufacturer: Bourns; Manufacturer Today: Bourns [br]; Tolerance: ±5%; КРР 15 по НД: 13$0,5; t: -55…+125°C; Автор: Стулов Н. Н.; Длина (L): 1мм; Ширина (W): 0.5мм; Высота (H): 0.35мм; TKC: ±200ppm/°C; Наименование BOM: Резистор 510Ом ±5% CR0402-JW-511, Bourns; Наименование КРР: Резистор CR0402-JW-511; Наименование КРР ф4: Резистор CR0402; КРР ф4_9: -55; КРР ф4_10: 125; КРР Форма: 68; КРР 1 по НД: 25; КРР 13 по НД: 0,0625; КРР 14 по НД: от -55 до 125; № п/п: 60; Масса (m): 0.1г; Дескрипторы: 510 510R; BCPId_old: Rbr00660; Наличие: 0|53|0; BCPId: 9000002353020; ComponentLink1Description: DataSheet; ComponentLink1URL: L:\Links\DataSheet\Bourns\CR0402.pdf; Дата создания: 12.11.2012; Power\Voltage: 0.0625Вт; КРР 2 по НД: 25; КРР 3 по НД: 25; КРР 4 по НД: 25; Rem: *; Аналоги: *; КРР 1 по схеме: *; КРР 2 по схеме: *; КРР 3 по схеме: *; КРР 13 по схеме: *; КРР 14 по схеме: *; Дата ревизии: 19.09.2022
RV1 RV2 = 9000003788173: 9mm, Snap-In Insulated Shaft Potentiometer; Manufacturer: Song Huei; Manufacturer Today: _China [cn]; Корпус: 9.7x6.8 H9.7 F2.5 d0.8; КРР 15 по НД: 13$0,5; КРР 14 по схеме: от -50 до 70; _NameSCH: "Name SCH"; _NamePCB: {Name_PCB}; № п/п: 1; t: -10…+70°C; Автор: Стулова И. Н.; Длина (L): 9.7мм; Ширина (W): 6.8мм; Между выводами (F): 2.5мм; Диаметр выводов (d): 0.8мм; Tolerance: ±20%; Power\Voltage: 0.05Вт; Наименование BOM: Резистор переменный 1кОм ±20% R0901N-A1K, L25KQ, Song Huei; Наименование КРР: Резистор переменный  R0901N-A1K, L25KQ; Наименование КРР ф4: Резистор переменный R0901N; КРР ф4_9: -10; КРР ф4_10: 70; КРР Форма: 68; КРР 1 по НД: 50; КРР 13 по НД: 0,05; КРР 14 по НД: от -10 до 70; Наличие: 0; BCPId_old: Rcn00002; ManufacturerPartNumber: R0901N-A1K, L25KQ; BCPId: 9000003788173; Rem: *; Аналоги: *; КРР 1 по схеме: *; КРР 2 по схеме: *; КРР 3 по схеме: *; КРР 13 по схеме: *; ComponentLink1Description: DataSheet; ComponentLink1URL: L:\Links\DataSheet\_China\R0901N `Song Huei.pdf; Дата создания: 14.06.2016; Дата ревизии: 14.06.2016; Высота (H): 9.7мм; КРР 2 по НД: 50; КРР 3 по НД: 50; КРР 4 по НД: 50
SB1 SB2 = 9000003790121: Push Button Switch; Manufacturer: Китай; Manufacturer Today: _China [cn]; Автор: Стулов Н. Н.; КРР 14 по НД: 5$0,5; КРР 13 по схеме: от -50 до 70; _NameSCH: "Name SCH"; _NamePCB: {Name_PCB}; № п/п: 2; t: -25…+85°C; Корпус: 12x12 H25 F4.5 d2.8; Длина (L): D12мм; Высота (H): 25мм; Шаг (F): 4.5мм; Диаметр выводов (d): 2.8мм; Наименование: Переключатель кнопочный; Наименование BOM: Переключатель кнопочный DS-314, Китай; Наименование КРР: Переключатель кнопочный DS-314; КРР ф4_9: -25; КРР ф4_10: 85; КРР Форма: 81; КРР 3 по НД: 250; КРР 5 по НД: 1000; КРР 13 по НД: от -25 до 85; BCPId_old: Scn00008; Наличие: 7; ManufacturerPartNumber: DS-314; BCPId: 9000003790121; Rem: *; Аналоги: *; КРР 3 по схеме: *; КРР 5 по схеме: *; ComponentLink1Description: DataSheet; ComponentLink1URL: L:\Links\DataSheet\_China\DS-314.pdf; ComponentLink2Description: DataSheet 2; ComponentLink2URL: L:\Links\DataSheet\_China\DS-314 `Alt1.pdf; Дата создания: 02.03.2015; Дата ревизии: 21.09.2023; Ширина (W): D12мм; Наименование КРР ф4: Переключатель кнопочный DS-314
VD1 VD2 = 9000003798554: 0.05A, 18В. Два диода Шоттки кремниевых эпитаксиально-планарных, последовательно соединенных; Manufacturer: АЕЯР.432120.554 ТУ; Manufacturer Today: Интеграл; Корпус: КТ-46A; Аналоги: HSMS2812; КРР 10 по НД: 6$0,7; № п/п: 5; t: -60…+100°C; Автор: Стулов Н. Н.; Длина (L): 2.9мм; Ширина (W): 1.3мм; Высота (H): 1мм; Шаг (F): 1.9мм; Масса (m): 0.1г; Наименование BOM: Сборка диодная 2ДШ142АС9 - АЕЯР.432120.554 ТУ, Интеграл; Наименование ПЭ3: 2ДШ142АС9 - АЕЯР.432120.554 ТУ; Наименование КРР: Сборка диодная 2ДШ142АС9 - АЕЯР.432120.554 ТУ; Наименование КРР ф4: Сборка диодная 2ДШ142; КРР ф4_1: 160000; КРР ф4_2: 25; КРР ф4_4: от 50 до 10000; КРР ф4_5: 170; КРР ф4_9: -60; КРР ф4_10: 100; КРР ф4_11: 95; КРР Форма: 55; КРР 1 по НД: 50; КРР 4 по НД: 70; КРР 5 по НД: 10; КРР 6 по НД: 18; КРР 7 по НД: 500000; КРР 9 по НД: от -60 до 100; BCPId_old: V00115; Наличие: 0|36|0; BCPId: 9000003798554; Rem: *; КРР 1 по схеме: *; КРР 4 по схеме: *; КРР 5 по схеме: *; КРР 6 по схеме: *; КРР 7 по схеме: *; КРР 8 по схеме: *; КРР 9 по схеме: *; ComponentLink1Description: DataSheet; ComponentLink1URL: L:\Links\DataSheet\Интеграл\2ДШ142.pdf; ComponentLink2Description: ТУ; ComponentLink2URL: L:\Links\ТУ\АЕЯР.432120.554 ТУ `Диоды 2ДШ142А.pdf; ComponentLink3Description: Case; ComponentLink3URL: L:\Links\Case\SOT-23S.pdf; ComponentLink4Description: Case 2; ComponentLink4URL: L:\Links\Case\SOT23 `Diodes.pdf; ComponentLink5Description: Case 3; ComponentLink5URL: L:\Links\Case\SOT23 `NXP.pdf; ComponentLink6Description: Case 4; ComponentLink6URL: L:\Links\Case\SOT23 (Standard) `Diodes.pdf; ComponentLink7Description: Case 5; ComponentLink7URL: L:\Links\Case\SOT23 (Type BR) `Diodes.pdf; ComponentLink8Description: Перечень ЭКБ 03-2020, с. 25; ComponentLink8URL: L:\Links\ЭКБ\2020\3.1.pdf; Дата создания: 06.03.2017; Дата ревизии: 06.03.2017; Power\Voltage: 0.05A, 18В; КРР ф4_3: 25; КРР 8 по НД: 55
XP1 = 9000003830483: Вилка штыревая 2.54мм 1x12 прямая; Manufacturer: Ningbo Connfly Electronic; Manufacturer Today: Ningbo Connfly Electronic [ds]; Автор: Стулов Н. Н.; Аналоги: PLS-12; КРР 22 по схеме: от -50 до 70; _NamePCB: {Name_PCB}; № п/п: 323; t: -40…+105°C; Корпус: 31x2.5 H8.6 F2.54 d0.6; Длина (L): 30.98мм; Высота (H): 8.6мм; Диаметр выводов (d): 0.64мм; Наименование BOM: Вилка DS1021-1*12S61, Ningbo Connfly Electronic; Наименование КРР: Вилка DS1021-1*12S61; Наименование КРР ф4: Вилка DS1021; КРР ф4_9: -40; КРР ф4_10: 105; КРР Форма: 75; КРР 1 по НД: пост./перем.; КРР 2 по НД: 3; КРР 3 по НД: 250; КРР 22 по НД: от -40 до 105; КРР 24 по НД: 3$0,9; BCPId_old: Xds00050; Наличие: 0; ManufacturerPartNumber: DS1021-1*12S61; BCPId: 9000003830483; Rem: *; КРР 1 по схеме: *; КРР 2 по схеме: *; КРР 3 по схеме: *; ComponentLink1Description: DataSheet; ComponentLink1URL: L:\Links\DataSheet\Ningbo Connfly Electronic\DS1021 `PLS(D)(T).pdf; Дата создания: 15.08.2016; Дата ревизии: 15.08.2016; Ширина (W): 2.54мм; Шаг (F): 2.54мм; Наименование: Вилка
XS1 = SWD_6pin
XS2 = XS str_prd_1: B2P-VH (PWL2-02), Вилка прямая на плату (к VHR) 3.96мм
XS3 = XS 30V: B2P-VH (PWL2-02), Вилка прямая на плату (к VHR) 3.96мм
XS4 = XS 5V: B2P-VH (PWL2-02), Вилка прямая на плату (к VHR) 3.96мм
Z1 = 9000003908410: Signal Lines Type Chip Ferrite Bead - 0603 size for general signal lines; Manufacturer: Murata; Manufacturer Today: Murata [mu]; t: -55…+125°C; Автор: Стулов Н. Н.; Длина (L): 1.6мм; Ширина (W): 0.8мм; Корпус: 0603; Наименование BOM: Фильтр BLM18AG102SN1, Murata; Наименование КРР: Фильтр BLM18AG102SN1; Наименование КРР ф4: Фильтр BLM18AG; КРР 3 по НД: 400; КРР 6 по НД: от -55 до 125; КРР 7 по НД: 3$0,7; КРР 6 по схеме: от -50 до 70; № п/п: 178; Масса (m): 0.1г; КРР ф4_9: -55; КРР ф4_10: 125; КРР Форма: 86; BCPId_old: Zmu00176; Наличие: 0|0|194; ManufacturerPartNumber: BLM18AG102SN1; BCPId: 9000003908410; ComponentLink1Description: DataSheet; ComponentLink1URL: L:\Links\DataSheet\Murata\C31E SMD_BLOCK Type EMI Suppression Filters EMIFIL 2013-08-01.pdf; Дата создания: 19.12.2013; Высота (H): 0.8мм; Rem: *; Аналоги: *; КРР 3 по схеме: *; ComponentLink2Description: Виза; ComponentLink2URL: L:\Links\Виза\p\p2 `Приложение 2-номенклатура-ПЛ.pdf; Дата ревизии: 19.12.2013